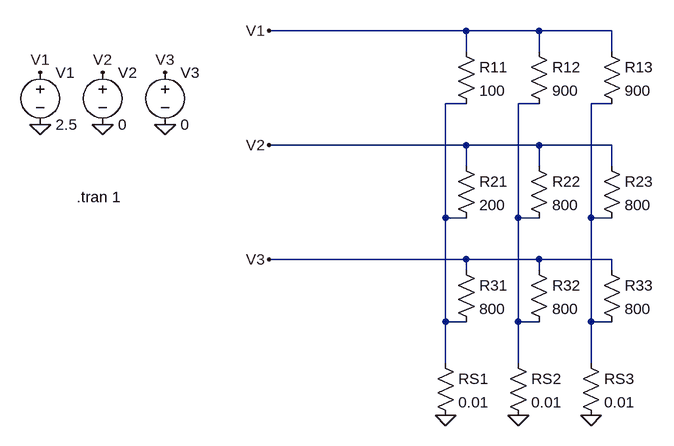
[diagram p0: schematic Week5_my_crossbar_3x3.asc]
Week5_my_crossbar_3x3.asc, the LTspice schematic file:
Version 4
SHEET 1 880 728
WIRE 128 64 -176 64
WIRE 240 64 128 64
WIRE 352 64 240 64
WIRE 128 96 128 64
WIRE 240 96 240 64
WIRE 352 96 352 64
WIRE 128 176 96 176
WIRE 240 176 208 176
WIRE 352 176 320 176
WIRE 128 240 -176 240
WIRE 240 240 128 240
WIRE 352 240 240 240
WIRE 128 272 128 240
WIRE 240 272 240 240
WIRE 352 272 352 240
WIRE 96 352 96 176
WIRE 128 352 96 352
WIRE 208 352 208 176
WIRE 240 352 208 352
WIRE 320 352 320 176
WIRE 352 352 320 352
WIRE 128 416 -176 416
WIRE 240 416 128 416
WIRE 352 416 240 416
WIRE 128 432 128 416
WIRE 240 432 240 416
WIRE 352 432 352 416
WIRE 96 512 96 352
WIRE 128 512 96 512
WIRE 208 512 208 352
WIRE 240 512 208 512
WIRE 320 512 320 352
WIRE 352 512 320 512
WIRE 96 576 96 512
WIRE 208 576 208 512
WIRE 320 576 320 512
FLAG -432 208 0
FLAG -176 64 V1
FLAG -176 240 V2
FLAG -528 208 0
FLAG -528 128 V1
FLAG -432 128 V2
FLAG -176 416 V3
FLAG -336 208 0
FLAG -336 128 V3
FLAG 96 656 0
FLAG 208 656 0
FLAG 320 656 0
SYMBOL res 112 80 R0
SYMATTR InstName R11
SYMATTR Value 100
SYMBOL res 224 80 R0
SYMATTR InstName R12
SYMATTR Value 900
SYMBOL res 112 256 R0
SYMATTR InstName R21
SYMATTR Value 200
SYMBOL res 224 256 R0
SYMATTR InstName R22
SYMATTR Value 800
SYMBOL voltage -528 112 R0
WINDOW 123 0 0 Left 0
WINDOW 39 0 0 Left 0
SYMATTR InstName V1
SYMATTR Value 2.5
SYMBOL voltage -432 112 R0
WINDOW 123 0 0 Left 0
WINDOW 39 0 0 Left 0
SYMATTR InstName V2
SYMATTR Value 0
SYMBOL res 80 560 R0
SYMATTR InstName RS1
SYMATTR Value 0.01
SYMBOL res 336 80 R0
SYMATTR InstName R13
SYMATTR Value 900
SYMBOL res 336 256 R0
SYMATTR InstName R23
SYMATTR Value 800
SYMBOL res 112 416 R0
SYMATTR InstName R31
SYMATTR Value 800
SYMBOL res 224 416 R0
SYMATTR InstName R32
SYMATTR Value 800
SYMBOL res 336 416 R0
SYMATTR InstName R33
SYMATTR Value 800
SYMBOL voltage -336 112 R0
WINDOW 123 0 0 Left 0
WINDOW 39 0 0 Left 0
SYMATTR InstName V3
SYMATTR Value 0
SYMBOL res 192 560 R0
SYMATTR InstName RS2
SYMATTR Value 0.01
SYMBOL res 304 560 R0
SYMATTR InstName RS3
SYMATTR Value 0.01
TEXT -472 320 Left 2 !.tran 1

The netlist it stands for:
* Week5_my_crossbar_3x3.asc
R11 V1 N001 100
R12 V1 N002 900
R21 V2 N001 200
R22 V2 N002 800
V1 V1 0 2.5
V2 V2 0 0
RS1 N001 0 0.01
R13 V1 N003 900
R23 V2 N003 800
R31 V3 N001 800
R32 V3 N002 800
R33 V3 N003 800
V3 V3 0 0
RS2 N002 0 0.01
RS3 N003 0 0.01
.tran 1
.backanno
.end